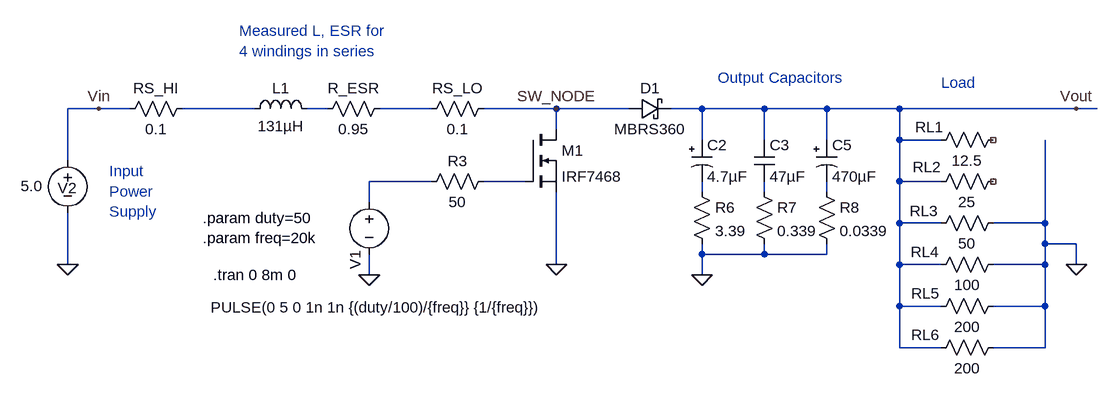
[diagram p0: schematic OL_Boost_concept_actual.asc]
OL_Boost_concept_actual.asc, the LTspice schematic file:
Version 4
SHEET 1 2776 696
WIRE -336 -400 -384 -400
WIRE -288 -400 -336 -400
WIRE -96 -400 -208 -400
WIRE 16 -400 -16 -400
WIRE 176 -400 96 -400
WIRE 368 -400 256 -400
WIRE 480 -400 368 -400
WIRE 592 -400 544 -400
WIRE 688 -400 592 -400
WIRE 784 -400 688 -400
WIRE 896 -400 784 -400
WIRE 1168 -400 896 -400
WIRE 1200 -400 1168 -400
WIRE 368 -368 368 -400
WIRE 592 -352 592 -400
WIRE 688 -352 688 -400
WIRE 784 -352 784 -400
WIRE 896 -352 896 -400
WIRE 960 -352 896 -352
WIRE -384 -320 -384 -400
WIRE 176 -288 80 -288
WIRE 320 -288 256 -288
WIRE 896 -288 896 -352
WIRE 960 -288 896 -288
WIRE 592 -272 592 -288
WIRE 688 -272 688 -288
WIRE 784 -272 784 -288
WIRE 80 -256 80 -288
WIRE 896 -224 896 -288
WIRE 960 -224 896 -224
WIRE 1120 -224 1120 -352
WIRE 1120 -224 1040 -224
WIRE 1120 -192 1120 -224
WIRE 1168 -192 1120 -192
WIRE 592 -176 592 -192
WIRE 688 -176 688 -192
WIRE 688 -176 592 -176
WIRE 784 -176 784 -192
WIRE 784 -176 688 -176
WIRE -384 -160 -384 -240
WIRE 368 -160 368 -272
WIRE 896 -160 896 -224
WIRE 960 -160 896 -160
WIRE 1120 -160 1120 -192
WIRE 1120 -160 1040 -160
WIRE 1168 -160 1168 -192
WIRE 80 -144 80 -176
WIRE 592 -144 592 -176
WIRE 896 -96 896 -160
WIRE 960 -96 896 -96
WIRE 1120 -96 1120 -160
WIRE 1120 -96 1040 -96
WIRE 896 -32 896 -96
WIRE 960 -32 896 -32
WIRE 1120 -32 1120 -96
WIRE 1120 -32 1040 -32
FLAG -336 -400 Vin
FLAG 368 -160 0
FLAG 1168 -400 Vout
FLAG 368 -400 SW_NODE
FLAG 80 -144 0
FLAG -384 -160 0
FLAG 592 -144 0
FLAG 1168 -160 0
SYMBOL voltage 80 -272 R0
WINDOW 123 0 0 Left 2
WINDOW 39 0 0 Left 2
WINDOW 3 272 178 Right 2
WINDOW 0 -21 90 VRight 2
SYMATTR Value PULSE(0 5 0 1n 1n {(duty/100)/{freq}} {1/{freq}})
SYMATTR InstName V1
SYMBOL voltage -384 -336 R0
WINDOW 123 0 0 Left 2
WINDOW 39 0 0 Left 2
WINDOW 0 -15 58 Left 2
WINDOW 3 -72 55 Left 2
SYMATTR InstName V2
SYMATTR Value 5.0
SYMBOL res 944 -272 R270
WINDOW 0 23 -6 VTop 2
WINDOW 3 0 56 VBottom 2
SYMATTR InstName RL2
SYMATTR Value 25
SYMBOL ind -112 -384 R270
WINDOW 0 32 56 VTop 2
WINDOW 3 5 56 VBottom 2
SYMATTR InstName L1
SYMATTR Value 131µH
SYMATTR SpiceLine Cpar=500pF
SYMBOL schottky 480 -384 R270
WINDOW 0 32 32 VTop 2
WINDOW 3 0 32 VBottom 2
SYMATTR InstName D1
SYMATTR Value MBRS360
SYMATTR Description Diode
SYMATTR Type diode
SYMBOL cap 672 -352 R0
SYMATTR InstName C3
SYMATTR Value 47µF
SYMBOL polcap 576 -352 R0
SYMATTR InstName C2
SYMATTR Value 4.7µF
SYMBOL nmos 320 -368 R0
SYMATTR InstName M1
SYMATTR Value IRF7468
SYMBOL res 112 -416 R90
WINDOW 0 0 56 VBottom 2
WINDOW 3 32 56 VTop 2
SYMATTR InstName R_ESR
SYMATTR Value 0.95
SYMBOL res 944 -208 R270
WINDOW 0 19 -10 VTop 2
WINDOW 3 0 56 VBottom 2
SYMATTR InstName RL3
SYMATTR Value 50
SYMBOL res -192 -416 R90
WINDOW 0 0 56 VBottom 2
WINDOW 3 32 56 VTop 2
SYMATTR InstName RS_HI
SYMATTR Value 0.1
SYMBOL res 272 -416 R90
WINDOW 0 0 56 VBottom 2
WINDOW 3 32 56 VTop 2
SYMATTR InstName RS_LO
SYMATTR Value 0.1
SYMBOL res 272 -304 R90
WINDOW 0 0 56 VBottom 2
WINDOW 3 32 56 VTop 2
SYMATTR InstName R3
SYMATTR Value 50
SYMBOL polcap 768 -352 R0
SYMATTR InstName C5
SYMATTR Value 470µF
SYMBOL res 576 -288 R0
SYMATTR InstName R6
SYMATTR Value 3.39
SYMBOL res 672 -288 R0
SYMATTR InstName R7
SYMATTR Value 0.339
SYMBOL res 768 -288 R0
SYMATTR InstName R8
SYMATTR Value 0.0339
SYMBOL res 944 -144 R270
WINDOW 0 20 -9 VTop 2
WINDOW 3 0 56 VBottom 2
SYMATTR InstName RL4
SYMATTR Value 100
SYMBOL res 944 -80 R270
WINDOW 0 20 -8 VTop 2
WINDOW 3 0 56 VBottom 2
SYMATTR InstName RL5
SYMATTR Value 200
SYMBOL res 944 -336 R270
WINDOW 0 20 -2 VTop 2
WINDOW 3 0 56 VBottom 2
SYMATTR InstName RL1
SYMATTR Value 12.5
SYMBOL res 944 -16 R270
WINDOW 0 20 -8 VTop 2
WINDOW 3 0 56 VBottom 2
SYMATTR InstName RL6
SYMATTR Value 200
TEXT -160 -144 Left 2 !.tran 0 8m 0
TEXT -176 -232 Left 2 !.param duty=50\n.param freq=20k
TEXT -320 -304 Left 2 ;Input\nPower\nSupply
TEXT 616 -448 Left 2 ;Output Capacitors
TEXT 960 -440 Left 2 ;Load
TEXT -120 -520 Left 2 ;Measured L, ESR for\n4 windings in series

The netlist it stands for:
* OL_Boost_concept_actual.asc
V1 N004 0 PULSE(0 5 0 1n 1n {(duty/100)/{freq}} {1/{freq}})
V2 Vin 0 5.0
RL2 Vout NC_01 25
L1 N001 N002 131µH Cpar=500pF
D1 SW_NODE Vout MBRS360
C3 Vout N007 47µF
C2 Vout N006 4.7µF
M1 SW_NODE N005 0 0 IRF7468
R_ESR N003 N002 0.95
RL3 Vout 0 50
RS_HI N001 Vin 0.1
RS_LO SW_NODE N003 0.1
R3 N005 N004 50
C5 Vout N008 470µF
R6 N006 0 3.39
R7 N007 0 0.339
R8 N008 0 0.0339
RL4 Vout 0 100
RL5 Vout 0 200
RL1 Vout NC_02 12.5
RL6 Vout 0 200
.model D D
.lib standard.dio
.model NMOS NMOS
.model PMOS PMOS
.lib standard.mos
.tran 0 8m 0
.param duty=50
.param freq=20k
* Input
* Power
* Supply
* Output Capacitors
* Load
* Measured L, ESR for
* 4 windings in series
.backanno
.end